# EAGLE design c64-magic-desk-cartridge-smd-256kb (EAGLE 9.4.2)
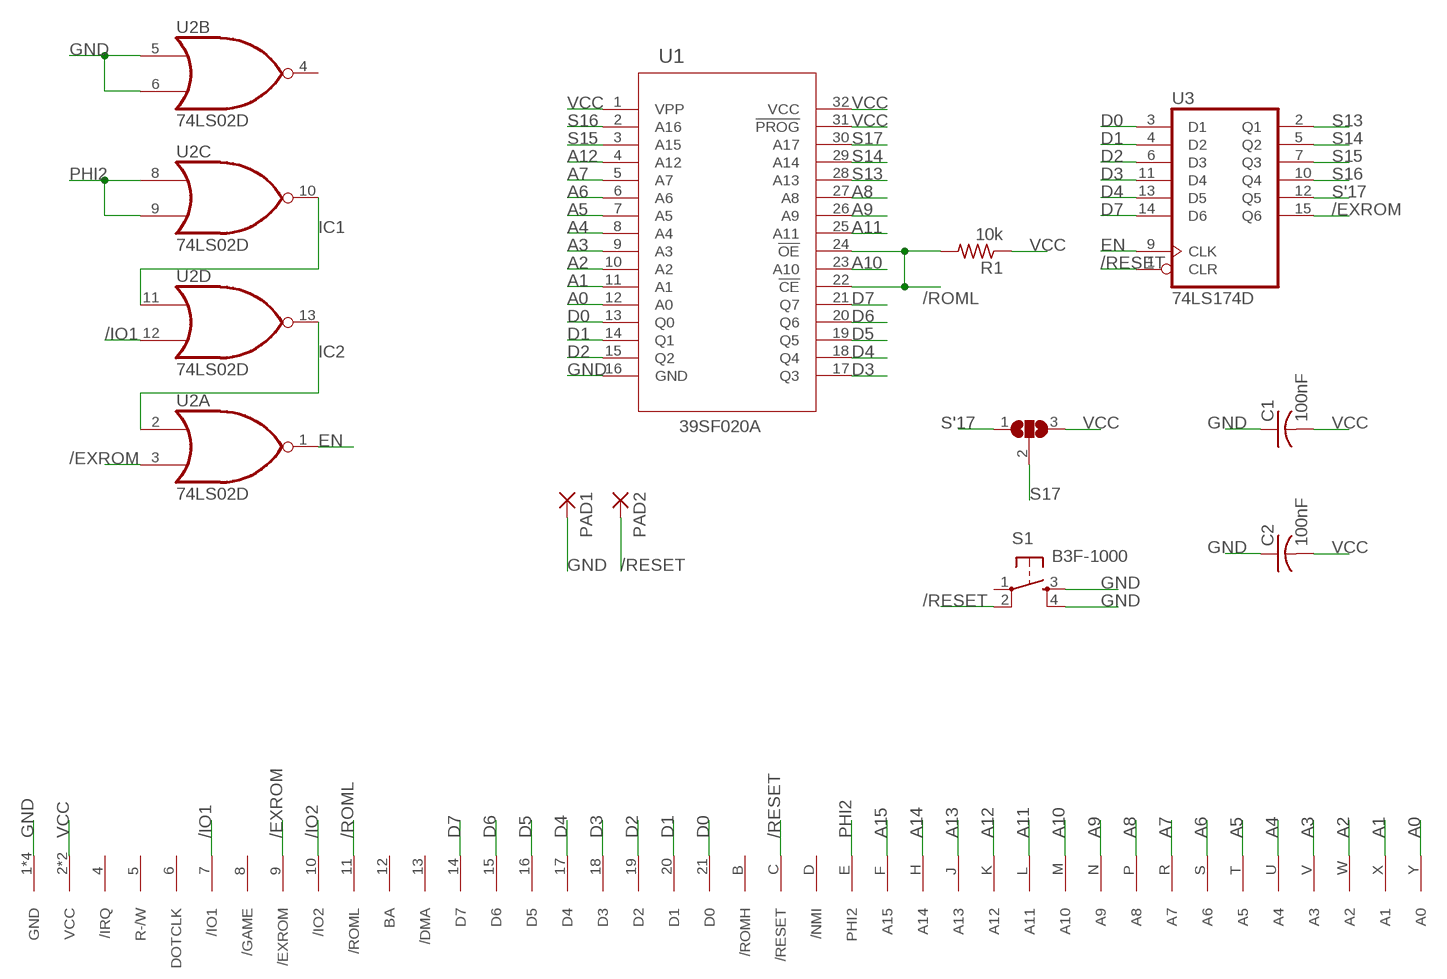
[diagram p0: schematic, sheet 1]

## Parts
C1  100nF  C-USC0805K  [C0805K]
C2  100nF  C-USC0805K  [C0805K]
PAD1  SMD2.54-5.08  [SMD2,54-5,08]
PAD2  SMD2.54-5.08  [SMD2,54-5,08]
R1  10k  R-US_R0805  [R0805]
S1  B3F-1000  [B3F-10XX]
SJ1  SJ2W  [SJ_2]
U1  M27C2001DIP32-LOWERED  [DIP32]
U2  74LS02D  [SO14]
U3  74LS174D  [SO16]
U$1  C64-EXPANSION-PORT  [EXPANSION_PORT]

## Nets
/EXROM: U2.3(A:I1) U3.15(Q6) U$1.9(/EXROM)
/IO1: U2.12(D:I1) U$1.7(/IO1)
/IO2: U$1.10(/IO2)
/RESET: PAD2.P$1(P) S1.2(P1) U3.1(CLR) U$1.C(/RESET)
/ROML: R1.2 U1.22(!CE) U1.24(!OE) U$1.11(/ROML)
A0: U1.12(A0) U$1.Y(A0)
A1: U1.11(A1) U$1.X(A1)
A2: U1.10(A2) U$1.W(A2)
A3: U1.9(A3) U$1.V(A3)
A4: U1.8(A4) U$1.U(A4)
A5: U1.7(A5) U$1.T(A5)
A6: U1.6(A6) U$1.S(A6)
A7: U1.5(A7) U$1.R(A7)
A8: U1.27(A8) U$1.P(A8)
A9: U1.26(A9) U$1.N(A9)
A10: U1.23(A10) U$1.M(A10)
A11: U1.25(A11) U$1.L(A11)
A12: U1.4(A12) U$1.K(A12)
A13: U$1.J(A13)
A14: U$1.H(A14)
A15: U$1.F(A15)
D0: U1.13(Q0) U3.3(D1) U$1.21(D0)
D1: U1.14(Q1) U3.4(D2) U$1.20(D1)
D2: U1.15(Q2) U3.6(D3) U$1.19(D2)
D3: U1.17(Q3) U3.11(D4) U$1.18(D3)
D4: U1.18(Q4) U3.13(D5) U$1.17(D4)
D5: U1.19(Q5) U$1.16(D5)
D6: U1.20(Q6) U$1.15(D6)
D7: U1.21(Q7) U3.14(D6) U$1.14(D7)
EN: U2.1(A:O) U3.9(CLK)
GND: C1.1 C2.1 PAD1.P$1(P) S1.3(S) S1.4(S1) U1.16(GND) U2.5(B:I0) U2.6(B:I1) U$1.1(GND) U$1.22(GND) U$1.A(GND) U$1.Z(GND)
IC1: U2.10(C:O) U2.11(D:I0)
IC2: U2.2(A:I0) U2.13(D:O)
PHI2: U2.8(C:I0) U2.9(C:I1) U$1.E(PHI2)
S13: U1.28(A13) U3.2(Q1)
S14: U1.29(A14) U3.5(Q2)
S15: U1.3(A15) U3.7(Q3)
S16: U1.2(A16) U3.10(Q4)
S17: SJ1.2 U1.30(A17)
S'17: SJ1.1 U3.12(Q5)
VCC: C1.2 C2.2 R1.1 SJ1.3 U1.1(VPP) U1.31(!PROG) U1.32(VCC) U$1.2(VCC) U$1.3(VCC)
Unconnected: S1.1(P) U2.4(B:O) U$1.4(/IRQ) U$1.5(R-/W) U$1.6(DOTCLK) U$1.8(/GAME) U$1.12(BA) U$1.13(/DMA) U$1.B(/ROMH) U$1.D(/NMI)

## Notes on the sheet
- 39SF020A

## Power pins joined to a net without a drawn wire
GND: U2.7(P:GND) U3.8(GND)
VCC: U2.14(P:VCC) U3.16(VCC)

## Library data of the parts
C1 C2 = rcl:C-US: CAPACITOR, American symbol; SPICEPREFIX: C
PAD1 PAD2 = pads-custom:SMD2.54-5.08
R1 = rcl:R-US_: RESISTOR, American symbol; SPICEPREFIX: R
S1 = omron-b3f-10xx:B3F-1000
SJ1 = jumper:SJ2W: SMD solder JUMPER
U1 = m27c2001-1:M27C2001
U2 = 74xx-us:74*02: Quad 2-input NOR gate
U3 = 74xx-us:74*174: Hex D type FLIP FLOP, clear
U$1 = c64-connectors:C64-EXPANSION-PORT

## Board
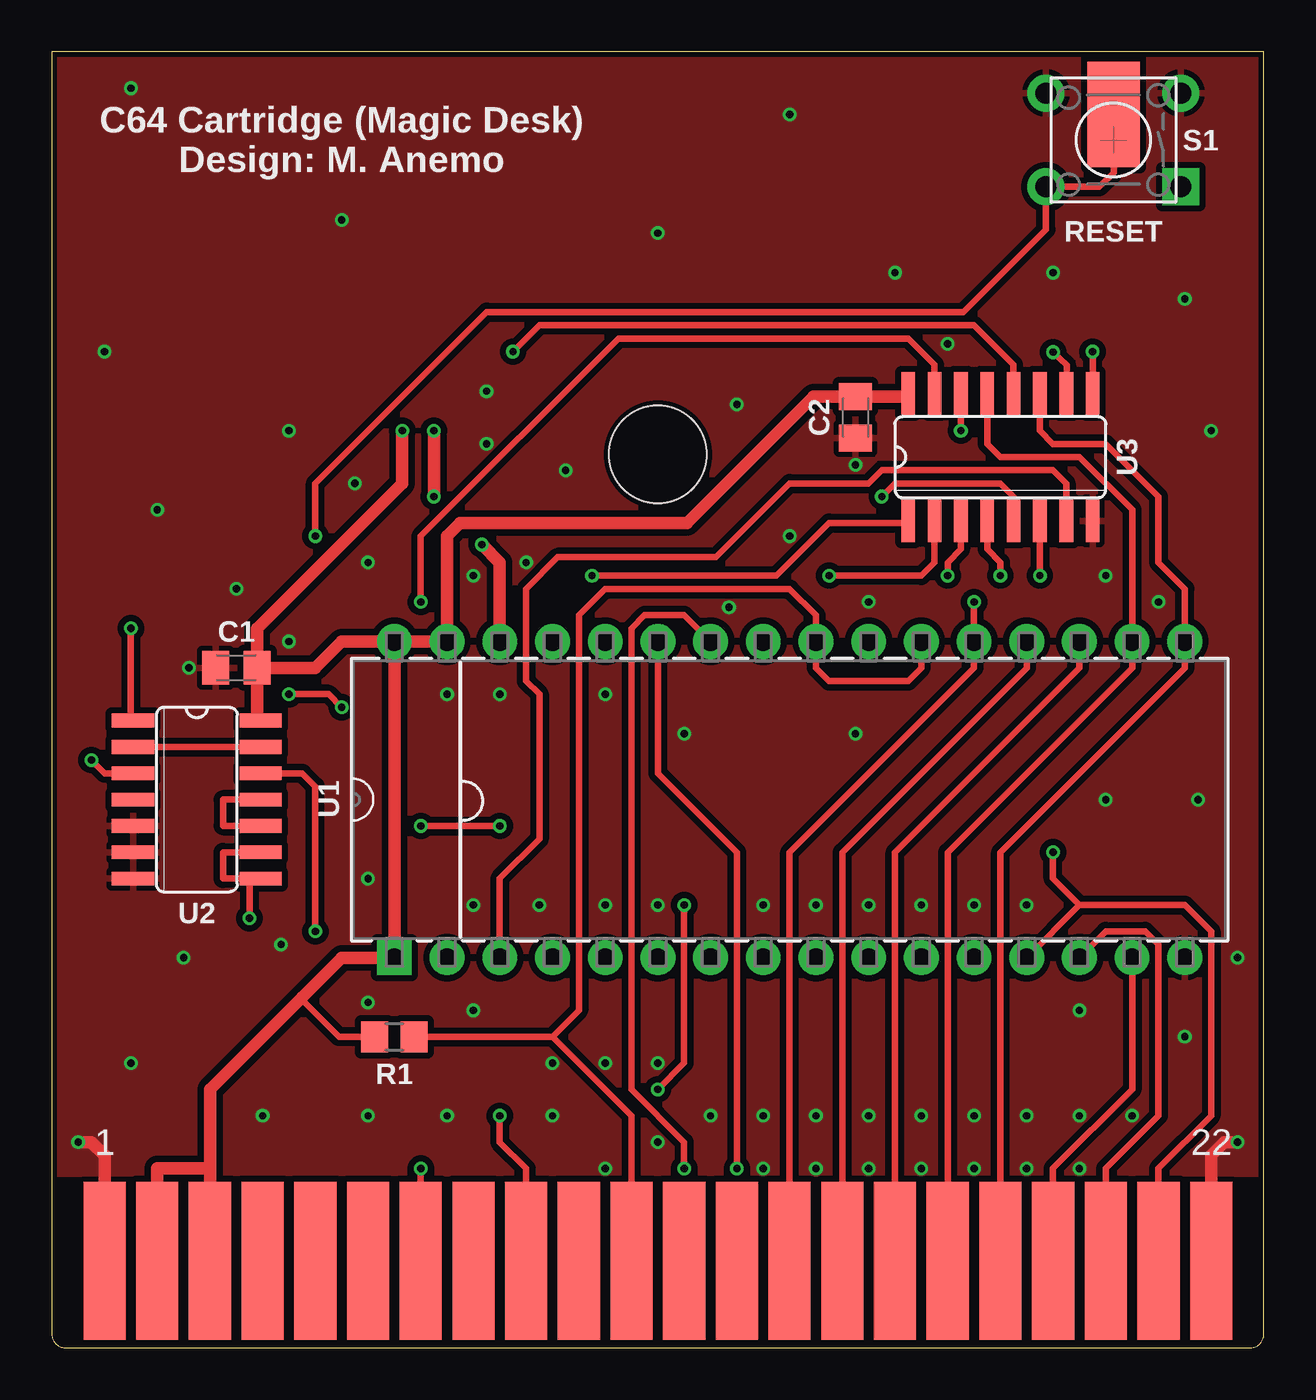
[diagram p1: board, top side]
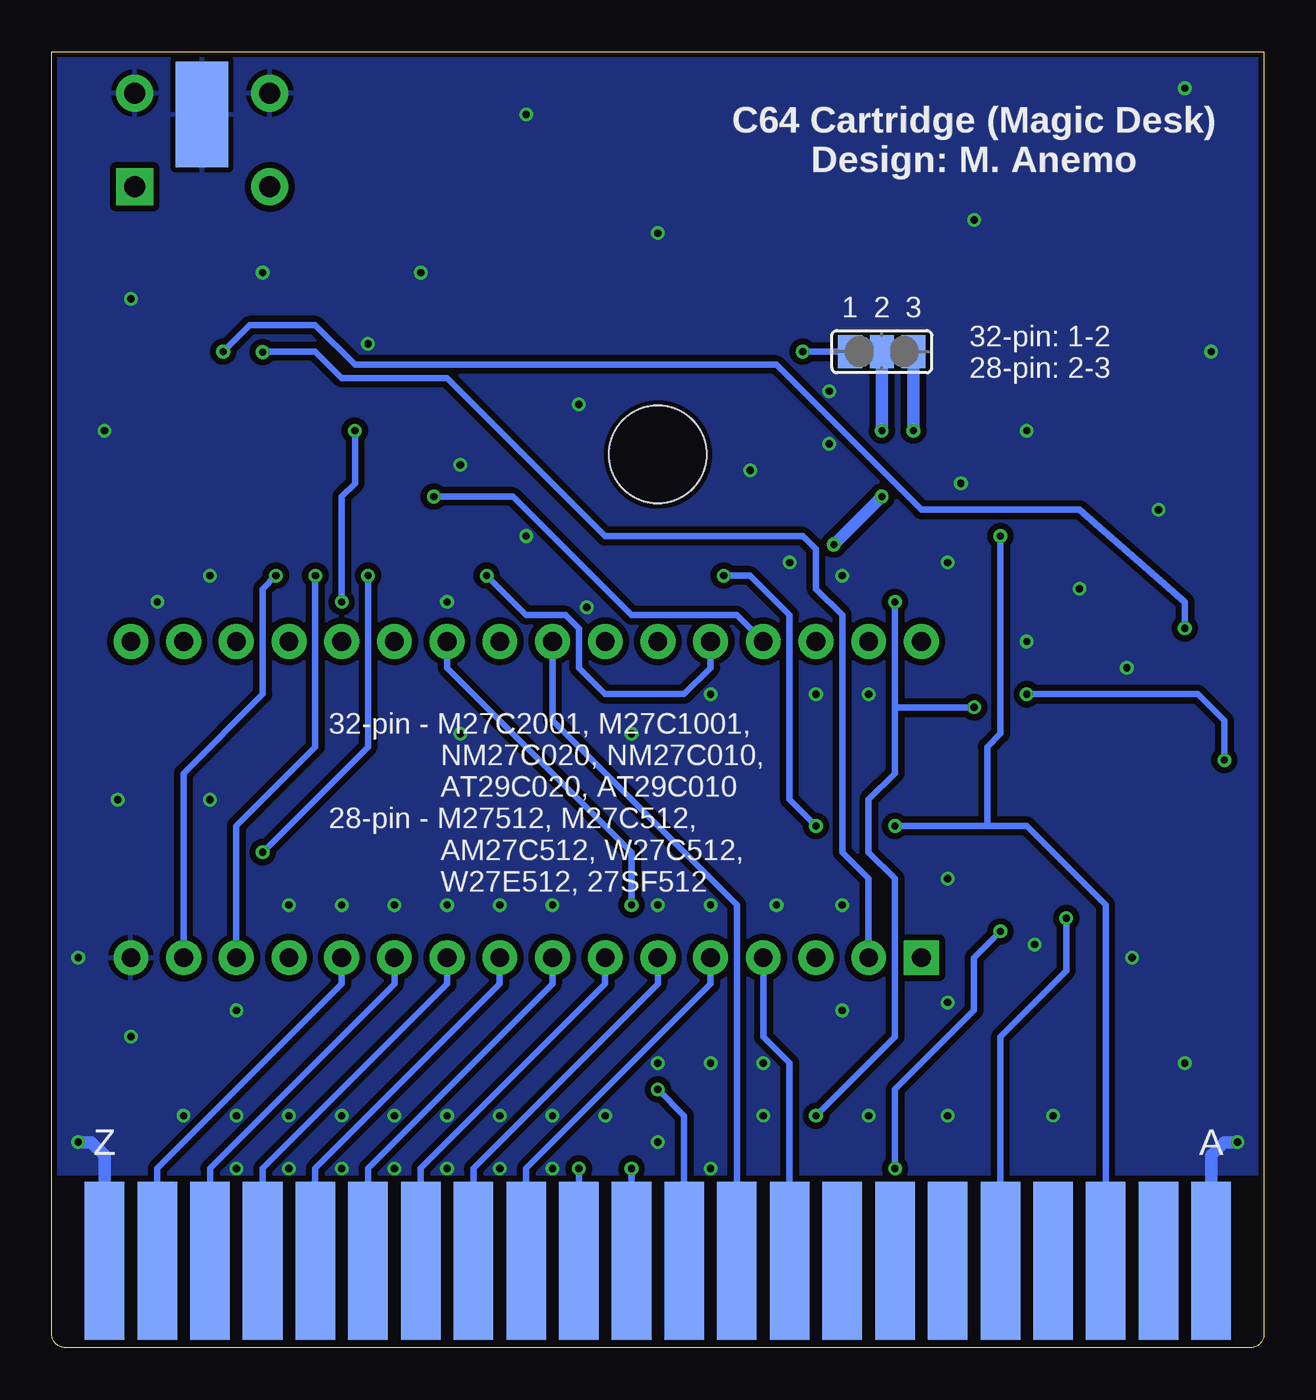
[diagram p2: board, bottom side, seen from below]

Size 58.42 x 62.46 mm. Coordinates in mm from the lower left corner, seen from the top.
Outline: 0,62.46 0,0.64 arc90 0.64,0 57.78,0 arc90 58.42,0.64 58.42,62.46 0,62.46
Copper layers (1*16): Top 0.035mm / dielectric 1.5mm / Bottom 0.035mm
Design rules "SeeedStudio_2layer_DRU_no_angle_20140221 *": minimum track width 6mil, minimum drill 12mil, track to track 12mil, track to pad 12mil, pad to pad 12mil, via to via 12mil, smd to smd 0mil, copper to edge 10mil, drill to drill 10mil, minimum pad ring 6mil, minimum via ring 6mil, stop-mask expansion 2mil, vias tented up to drill 100mil, thermal gap 10mil
Holes 4.7 mm at 29.21,43.05

### Footprints (pad centres in the part's own frame; a part is rotated, then mirrored left to right if it is on the bottom)
C0805K = smd 1.3 x 1.6: 1 -1,0; 2 1,0
SMD2,54-5,08 = smd 2.54 x 5.08: P$1 0,0
R0805 = smd 1.3 x 1.5: 1 -0.95,0; 2 0.95,0
B3F-10XX = drill 1.016 pad 1.778 square: 1 -3.251,2.261 | drill 1.016 pad 1.778: 2 3.251,2.261; 3 -3.251,-2.261; 4 3.251,-2.261
SJ_2 = smd 1.168 x 1.6: 1 -1.524,0; 2 0,0; 3 1.524,0
DIP32 = drill 0.9 pad 1.676 square: 1 -7.62,19.05 | drill 0.9 pad 1.676: 2 -7.62,16.51; 3 -7.62,13.97; 4 -7.62,11.43; 5 -7.62,8.89; 6 -7.62,6.35; 7 -7.62,3.81; 8 -7.62,1.27; 9 -7.62,-1.27; 10 -7.62,-3.81; 11 -7.62,-6.35; 12 -7.62,-8.89; 13 -7.62,-11.43; 14 -7.62,-13.97; 15 -7.62,-16.51; 16 -7.62,-19.05; 17 7.62,-19.05; 18 7.62,-16.51; 19 7.62,-13.97; 20 7.62,-11.43; 21 7.62,-8.89; 22 7.62,-6.35; 23 7.62,-3.81; 24 7.62,-1.27; 25 7.62,1.27; 26 7.62,3.81; 27 7.62,6.35; 28 7.62,8.89; 29 7.62,11.43; 30 7.62,13.97; 31 7.62,16.51; 32 7.62,19.05
SO14 = smd 0.66 x 2.032: 1 -3.81,-3.073; 2 -2.54,-3.073; 3 -1.27,-3.073; 4 0,-3.073; 5 1.27,-3.073; 6 2.54,-3.073; 7 3.81,-3.073; 8 3.81,3.073; 9 2.54,3.073; 10 1.27,3.073; 11 0,3.073; 12 -1.27,3.073; 13 -2.54,3.073; 14 -3.81,3.073
SO16 = smd 0.66 x 2.032: 1 -4.445,-3.073; 2 -3.175,-3.073; 3 -1.905,-3.073; 4 -0.635,-3.073; 5 0.635,-3.073; 6 1.905,-3.073; 7 3.175,-3.073; 8 4.445,-3.073; 9 4.445,3.073; 10 3.175,3.073; 11 1.905,3.073; 12 0.635,3.073; 13 -0.635,3.073; 14 -1.905,3.073; 15 -3.175,3.073; 16 -4.445,3.073
EXPANSION_PORT = smd 2.032 x 7.62: 1 -26.67,0; 2 -24.13,0; 3 -21.59,0; 4 -19.05,0; 5 -16.51,0; 6 -13.97,0; 7 -11.43,0; 8 -8.89,0; 9 -6.35,0; 10 -3.81,0; 11 -1.27,0; 12 1.27,0; 13 3.81,0; 14 6.35,0; 15 8.89,0; 16 11.43,0; 17 13.97,0; 18 16.51,0; 19 19.05,0; 20 21.59,0; 21 24.13,0; 22 26.67,0 | smd 1.905 x 7.62 bottom: A -26.67,0; B -24.13,0; C -21.59,0; D -19.05,0; E -16.51,0; F -13.97,0; H -11.43,0; J -8.89,0; K -6.35,0; L -3.81,0; M -1.27,0; N 1.27,0; P 3.81,0; R 6.35,0; S 8.89,0; T 11.43,0; U 13.97,0; V 16.51,0; W 19.05,0; X 21.59,0; Y 24.13,0; Z 26.67,0

### Placement (x,y rotation side)
C1  8.89,32.77 0 top
C2  38.73,44.83 90 top
PAD1  51.18,59.44 0 bottom
PAD2  51.18,59.44 0 top
R1  16.51,14.99 0 top
S1  51.17,58.21 180 top
SJ1  18.41,48.01 0 bottom
U1  35.56,26.42 90 top
U2  6.99,26.42 270 top
U3  45.72,42.93 0 top
U$1  29.21,4.19 0 top

### Tracks (layer width: path | path; a pad name or v marks a point on that pad's centre or on a via)
/EXROM  (via drill 0.35)
  Top 0.305: U3.15 42.54,47.37 41.27,48.64 27.3,48.64 17.78,39.12 v17.78,35.94 | v21.59,11.18 21.59,9.91 22.86,8.64 U$1.9 | U2.3 2.54,27.69 v1.9,28.32 | v13.97,30.86 13.34,31.5 v11.43,31.5
  Bottom 0.305: v17.78,35.94 17.78,30.86 | 17.78,30.86 17.78,27.69 19.05,26.42 19.05,23.88 17.78,22.61 17.78,14.99 v21.59,11.18 | 17.78,30.86 v13.97,30.86 | v11.43,31.5 3.18,31.5 1.9,30.23 v1.9,28.32
/IO1  (via drill 0.35)
  Top 0.305: v17.78,8.64 U$1.7 | U2.12 12.07,27.69 12.7,27.05 v12.7,20.07
  Bottom 0.305: v12.7,20.07 13.97,18.8 13.97,16.26 17.78,12.45 v17.78,8.64
/RESET  (via drill 0.35)
  Top 0.305: v17.78,25.15 v21.59,25.15 | v26.04,37.21 34.92,37.21 37.46,39.75 41.17,39.75 U3.1 | v12.7,39.12 12.7,41.66 20.96,49.91 43.94,49.91 47.92,53.89 S1.2 50.49,55.95 51.18,56.64 PAD2.P$1
  Bottom 0.305: 13.34,25.15 11.43,25.15 7.62,21.34 U$1.C | 13.34,25.15 v17.78,25.15 | v21.59,25.15 22.86,26.42 22.86,35.31 24.77,37.21 v26.04,37.21 | v12.7,39.12 12.7,29.59 13.34,28.96 13.34,25.15
/ROML
  Top 0.305: U1.22 41.91,32.77 41.27,32.13 37.46,32.13 36.83,32.77 U1.24 36.83,35.31 35.56,36.58 26.67,36.58 25.4,35.31 25.4,16.26 24.13,14.99 | R1.2 24.13,14.99 | 24.13,14.99 27.94,11.18 U$1.11
A0
  Bottom 0.305: U1.12 44.45,17.53 53.34,8.64 U$1.Y
A1
  Bottom 0.305: U1.11 41.91,17.53 50.8,8.64 U$1.X
A2
  Bottom 0.305: U1.10 39.37,17.53 48.26,8.64 U$1.W
A3
  Bottom 0.305: U1.9 36.83,17.53 45.72,8.64 U$1.V
A4
  Bottom 0.305: U1.8 34.29,17.53 43.18,8.64 U$1.U
A5
  Bottom 0.305: U1.7 31.75,17.53 40.64,8.64 U$1.T
A6
  Bottom 0.305: U1.6 29.21,17.53 38.1,8.64 U$1.S
A7
  Bottom 0.305: U1.5 26.67,17.53 35.56,8.64 U$1.R
A8  (via drill 0.35)
  Top 0.305: v33.02,8.64 33.02,23.88 29.21,27.69 U1.27
  Bottom 0.305: U$1.P v33.02,8.64
A9  (via drill 0.35)
  Top 0.305: U1.26 30.48,35.31 28.57,35.31 27.94,34.67 27.94,12.45 30.48,9.91 v30.48,8.64
  Bottom 0.305: v30.48,8.64 U$1.N
A10  (via drill 0.35)
  Top 0.305: v30.48,21.34 30.48,13.72 v29.21,12.45
  Bottom 0.305: U1.23 39.37,32.77 30.48,23.88 v30.48,21.34 | v29.21,12.45 27.94,11.18 U$1.M
A11
  Bottom 0.305: U$1.L 25.4,21.34 34.29,30.23 U1.25
A12
  Bottom 0.305: U$1.K 22.86,13.72 24.13,14.99 U1.4
D0  (via drill 0.35)
  Top 0.305: U1.13 49.53,21.34 | U$1.21 53.34,8.64 55.88,11.18 55.88,20.07 54.61,21.34 49.53,21.34 | U3.3 43.81,38.48 43.18,37.85 v43.18,37.21 | 49.53,21.34 48.26,22.61 v48.26,23.88
  Bottom 0.305: v48.26,23.88 43.18,28.96 v43.18,37.21
D1  (via drill 0.35)
  Top 0.305: U$1.20 50.8,8.64 53.34,11.18 53.34,19.43 52.7,20.07 50.8,20.07 U1.14 | U3.4 45.08,38.48 45.72,37.85 v45.72,37.21
  Bottom 0.305: U1.14 49.53,25.15 45.72,28.96 v45.72,37.21
D2  (via drill 0.35)
  Top 0.305: U$1.19 48.26,8.64 52.07,12.45 U1.15 | U3.6 v47.62,37.21
  Bottom 0.305: U1.15 52.07,27.69 48.26,31.5 48.26,36.58 v47.62,37.21
D3
  Top 0.305: U$1.18 45.72,23.88 54.61,32.77 U1.17 54.61,36.58 53.34,37.85 53.34,41.02 50.8,43.56 48.26,43.56 47.62,44.2 U3.11
D4
  Top 0.305: U$1.17 43.18,23.88 52.07,32.77 U1.18 52.07,40.39 49.53,42.93 45.72,42.93 45.08,43.56 U3.13
D5
  Top 0.305: U$1.16 40.64,23.88 49.53,32.77 U1.19
D6
  Top 0.305: U$1.15 38.1,23.88 46.99,32.77 U1.20
D7  (via drill 0.35)
  Top 0.305: U$1.14 35.56,23.88 44.45,32.77 U1.21 v44.45,35.94 | U3.14 v43.81,44.2
  Bottom 0.305: v43.81,44.2 43.81,41.66 44.45,41.02 v44.45,35.94
EN  (via drill 0.35)
  Top 0.305: U3.9 v50.16,48.01 | v3.81,34.67 3.81,30.23 U2.1
  Bottom 0.305: v3.81,34.67 3.81,35.94 8.89,40.39 16.51,40.39 23.5,47.37 43.81,47.37 45.72,49.28 48.89,49.28 v50.16,48.01
GND  (via drill 0.35)
  Top 0.61: U$1.22 55.88,9.27 56.51,9.91 v57.15,9.91 | U$1.1 2.54,9.27 1.9,9.91 v1.27,9.91
  Bottom 0.61: U$1.22 55.88,9.27 56.51,9.91 v57.15,9.91 | U$1.1 2.54,9.27 1.9,9.91 v1.27,9.91
  other vias: 41.91,11.18 44.45,11.18 52.07,11.18 39.37,11.18 36.83,11.18 34.29,11.18 31.75,11.18 26.67,13.72 26.67,31.5 19.05,31.5 24.13,11.18 19.05,11.18 15.24,11.18 10.16,11.18 29.21,21.34 30.48,29.59 38.73,29.59 36.83,21.34 39.37,21.34 41.91,21.34 44.45,21.34 46.99,11.18 49.53,11.18 49.53,16.26 49.53,8.64 46.99,8.64 44.45,8.64 41.91,8.64 39.37,8.64 36.83,8.64 26.67,8.64 34.29,8.64 50.8,26.42 24.77,42.29 20.32,21.34 29.21,13.72 22.86,37.85 34.29,21.34 23.5,21.34 20.96,46.1 14.61,41.66 32.64,35.69 15.24,37.85 26.67,21.34 39.37,35.94 50.8,37.21 29.21,53.72 55.88,44.2 6.35,18.8 6.6,32.77 38.73,42.55 35.56,39.12 53.34,35.94 20.96,43.56 11.43,34.04 20.32,37.21 24.13,13.72 20.32,16.26 55.24,26.42 43.18,48.39 15.24,16.64 21.59,31.5 11.05,19.43 46.99,21.34 29.21,9.91 35.56,59.44 5.08,40.39 2.54,48.01 8.89,36.58 33.02,45.47 48.26,51.82 54.61,14.99 3.81,13.72 40.64,51.82 13.97,54.36 11.43,44.2 57.15,18.8 54.61,50.55 15.24,22.61 3.81,60.71
  pour Top: -1.27,8.38 -1.27,66.42 59.69,66.42 59.69,8.38
  pour Bottom: -1.4,8.38 -1.27,66.42 59.69,66.42 59.56,8.38
IC1
  Top 0.305: U2.10 8.26,25.15 8.26,26.42 U2.11 10.79,26.42
IC2
  Top 0.305: U2.2 U2.13
PHI2  (via drill 0.35)
  Top 0.305: v9.53,20.7 9.53,22.5 U2.8 8.26,22.61 8.26,23.88 U2.9
  Bottom 0.305: U$1.E 12.7,14.99 9.53,18.16 v9.53,20.7
S13  (via drill 0.35)
  Top 0.305: U3.2 42.54,37.85 41.91,37.21 v37.46,37.21
  Bottom 0.305: U1.28 26.67,32.77 27.94,31.5 31.75,31.5 33.02,32.77 33.02,34.67 33.65,35.31 35.56,35.31 v37.46,37.21
S14  (via drill 0.35)
  Top 0.305: U3.5 46.35,41.02 45.72,41.66 40.64,41.66 v40,41.02
  Bottom 0.305: U1.29 25.4,35.31 30.48,35.31 36.2,41.02 v40,41.02
S15
  Top 0.305: U1.3 21.59,22.61 23.5,24.51 23.5,31.5 22.86,32.13 22.86,36.58 24.38,38.1 32,38.1 35.56,41.66 39.37,41.66 40,42.29 48.26,42.29 48.89,41.66 U3.7
S16  (via drill 0.35)
  Top 0.305: v48.26,47.98 48.92,47.35 48.89,46.74 U3.10
  Bottom 0.305: U1.2 19.05,22.61 20.32,23.88 20.32,35.31 21.59,36.58 21.59,38.48 22.23,39.12 31.75,39.12 39.37,46.74 44.45,46.74 45.72,48.01 48.24,48.01 v48.26,47.98
S17  (via drill 0.35)
  Top 0.61: U1.30 21.59,37.85 v20.73,38.71 | v18.41,41.02 v18.41,44.2
  Bottom 0.61: v20.73,38.71 v18.41,41.02 | SJ1.2 v18.41,44.2
S'17  (via drill 0.35)
  Top 0.305: U3.12 46.35,47.37 44.45,49.28 23.5,49.28 v22.23,48.01
  Bottom 0.305: v22.23,48.01 SJ1.1
VCC  (via drill 0.35)
  Top 0.305: R1.1 13.84,14.99 12.07,16.76 12.07,16.89
  Top 0.61: U$1.3 7.62,8.64 | 7.62,8.64 7.62,12.45 12.07,16.89 13.97,18.8 U1.1 U1.32 | U1.32 U1.31 19.05,39.12 19.68,39.75 30.61,39.75 36.7,45.85 38.72,45.85 C2.2 41.11,45.83 U3.16 | v16.89,44.2 16.89,41.66 9.89,34.66 C1.2 | C1.2 9.89,30.39 U2.14 | U$1.2 5.08,8.64 7.62,8.64 | U1.32 13.97,34.04 12.7,32.77 C1.2
  Bottom 0.61: v16.89,44.2 SJ1.3

### Text on the board
tNames: C64 Cartridge (Magic Desk) / Design: M. Anemo | RESET
bNames: C64 Cartridge (Magic Desk) / Design: M. Anemo | 3 | 2 | 1 | 32-pin: 1-2 / 28-pin: 2-3 | 32-pin - M27C2001, M27C1001, / NM27C020, NM27C010, / AT29C020, AT29C010 / 28-pin - M27512, M27C512, / AM27C512, W27C512, / W27E512, 27SF512